# Altium schematic sheet PSU.SchDoc
size A3
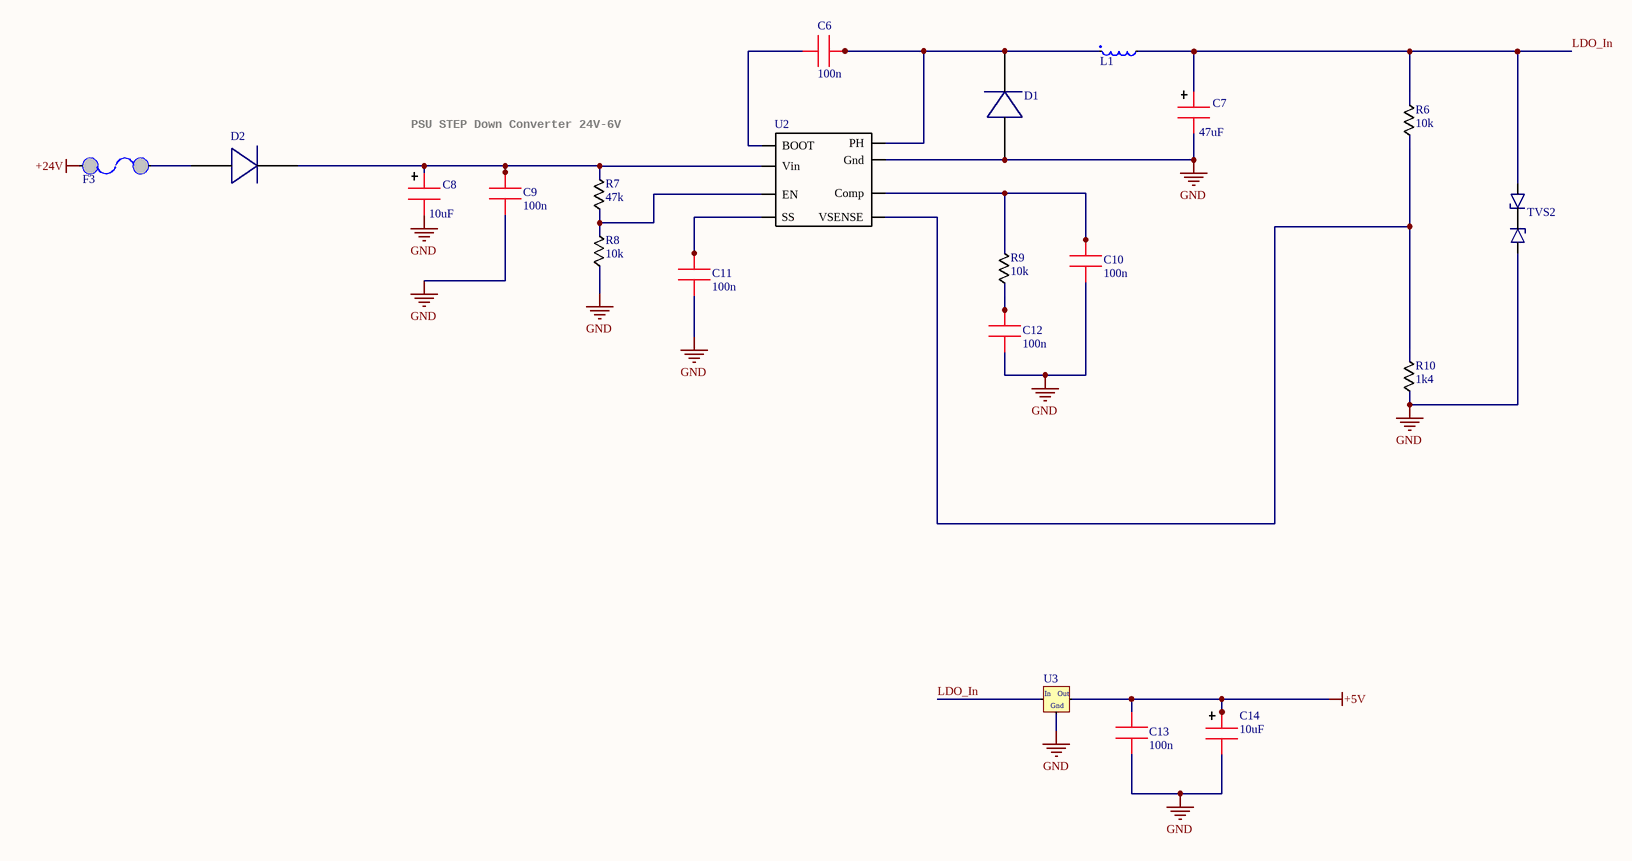
[diagram p0: PSU.SchDoc]

## Parts
C6  100n  [0603_CAP]
C7  47uF  [1206_CAP]
C9  100n  [0603_CAP]
C10  100n  [0603_CAP]
C11  100n  [0603_CAP]
C12  100n  [0603_CAP]
C13  100n  [0603_CAP]
C14  10uF  [1206_CAP]
D1  (no value)  [B340A-13-F]
D2  (no value)  [B340A-13-F]
F3  Fuse PTS  [Fuse USMF030]  (value not drawn)
L1  33u  [SRU1048]  (value not drawn)
R6  10k  [0603_RES]
R7  47k  [0603_RES]
R8  10k  [0603_RES]
R9  10k  [0603_RES]
R10  1k4  [0603_RES]
TVS2  (no value)  [DO-214AC]
U2  (no value)  [SOIC 8]
U3  (no value)  [SOT223]
С8  10uF  [1206_CAP]

## Nets
+5V: C13.1 C14.1 U3.2(OUT)
+24V: F3.0
GND: C7.2 C9.1 C10.1 C11.1 C12.1 C13.2 C14.2 D1.1(A) R8.1 R10.1 TVS2.1 U2.7(Gnd) U3.1(GND) С8.2
LDO_In: C7.1 L1.2 R6.2 TVS2.2 U3.3(IN)
NetC6_1: C6.1 U2.1(BOOT)
NetC6_2: C6.2 D1.2(C) L1.1 U2.8(PH)
NetC9_2: C9.2 D2.1(C) R7.2 U2.2(Vin) С8.1
NetC10_2: C10.2 R9.2 U2.6(Comp)
NetC11_2: C11.2 U2.4(SS)
NetC12_2: C12.2 R9.1
NetD2_2: D2.2(A) F3.1
NetR6_1: R6.1 R10.2 U2.5(VSENSE)
NetR7_1: R7.1 R8.2 U2.3(EN)

## Notes on the sheet
- PSU STEP Down Converter 24V-6V
- (in symbol NCV1117ST50T3G) In; Out; Gnd

## Library data of the parts
C6 C9-C13 = 0603 CAP: Part Description: Capacitor 0.1uF X7R 0603 10%; Part Number: CC0603KRX7R9BB104
C7 = 1206 Cap El: Part Description: 47 uF 10 VDC 10% 1210 X7R; Part Number: GRM32ER71A476KE15L
C14 = 1206 Cap El: Part Description: Ceramic Capacitor 10UF 50V 10% 1210; Part Number: GRM32ER71H106KA12L
D1 D2 = B340A-13-F: Part Description: Schottky Diodes & Rectifiers 60V 3A; Part Number: B360A-13-F
F3 = Fuse PTS: Part Description: PPTC 30V 50MA; Part Number: MF-USMF005-2
L1 = CDRH127: Part Description: 33uH 30% SMD 1048; Part Number: SRU1048-330Y
R6 R8 R9 = Resistor 0805: Part Description: Resistor 0603, 10kOhms, 1%, 1/10W; Part Number: RC0603FR-0710KL
R7 = Resistor 0805: Part Description: Resistor 0603, 47kOhms, 5%, 1/10W; Part Number: RC0603JR-0747K
R10 = Resistor 0805: Part Description: Resistor 0603, 1.4kOhms, 1%, 1/10W; Part Number: RC0603FR-071K4L
TVS2 = SM6T: Part Description: TVS Diodes 600W 12V Bidirect; Part Number: SM6T12CA
U2 = TPS54331: Part Description: Switching Voltage Regulators 3A 28V In Step Down SWIFT DC/DC; Part Number: TPS54331
U3 = NCV1117ST50T3G: Part Description: LDO Voltage Regulators 5 V; Part Number: LM1117MPX-5.0
С8 = 1206 Cap El: Part Description: Ceramic Capacitor 10uF X5R 1206 10%; Part Number: CC1206KKX5R9BB106